# EAGLE design Charger Board_3 (EAGLE 6.5.0)
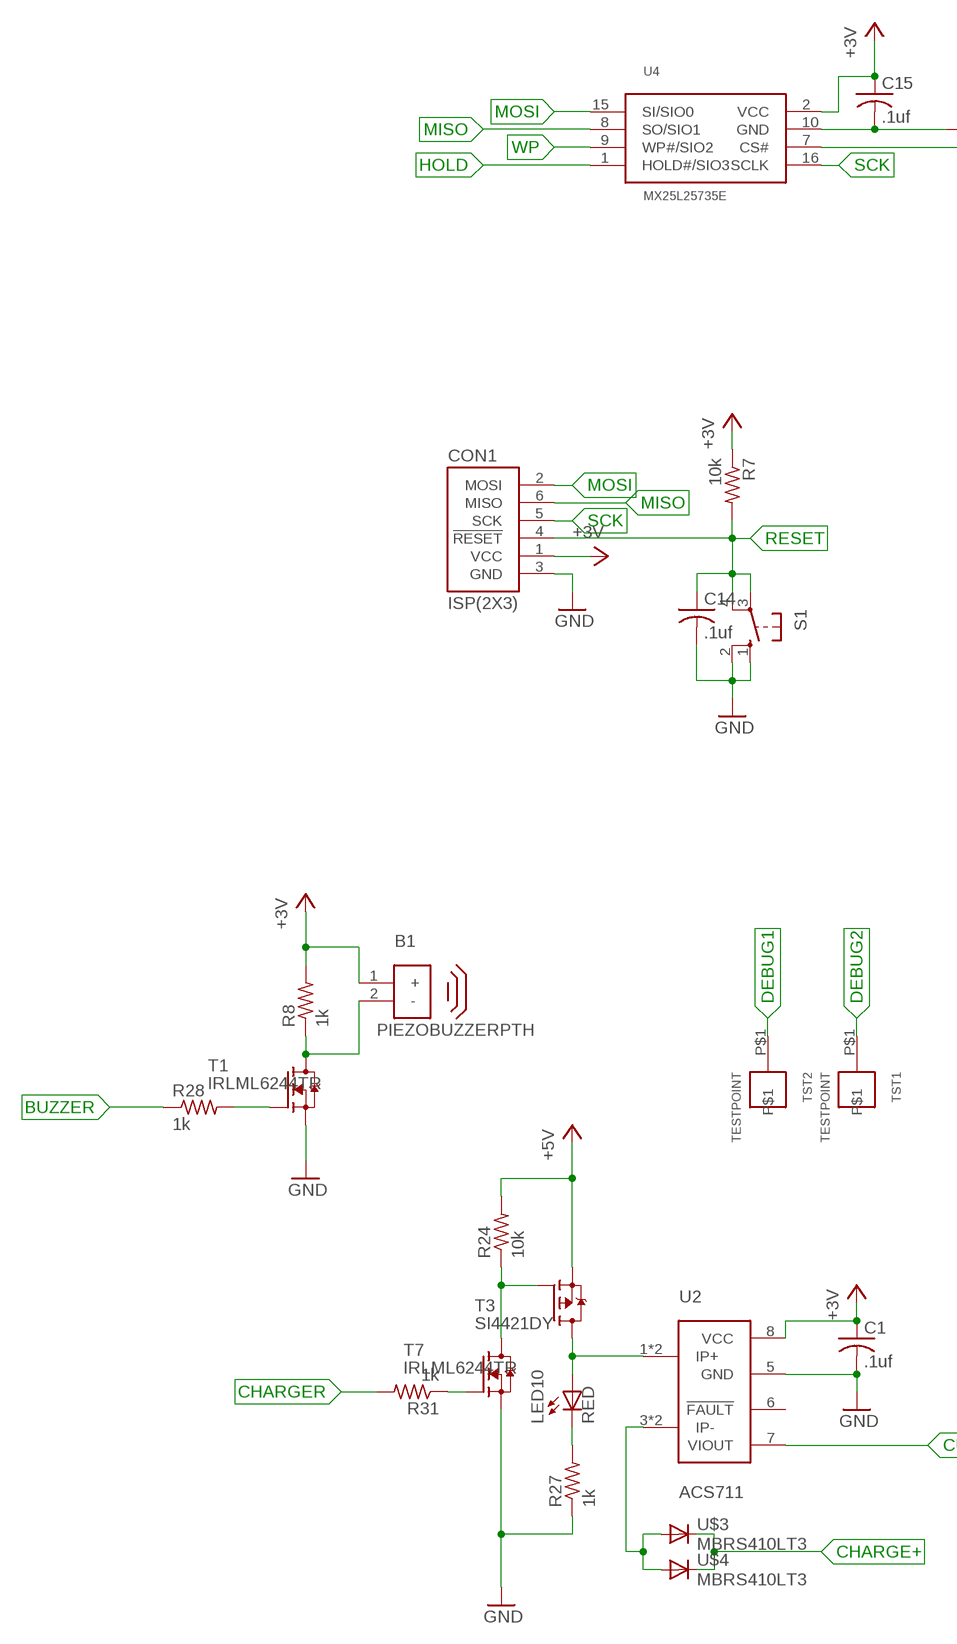
[diagram p0: schematic, sheet 1, part 1 of 2]
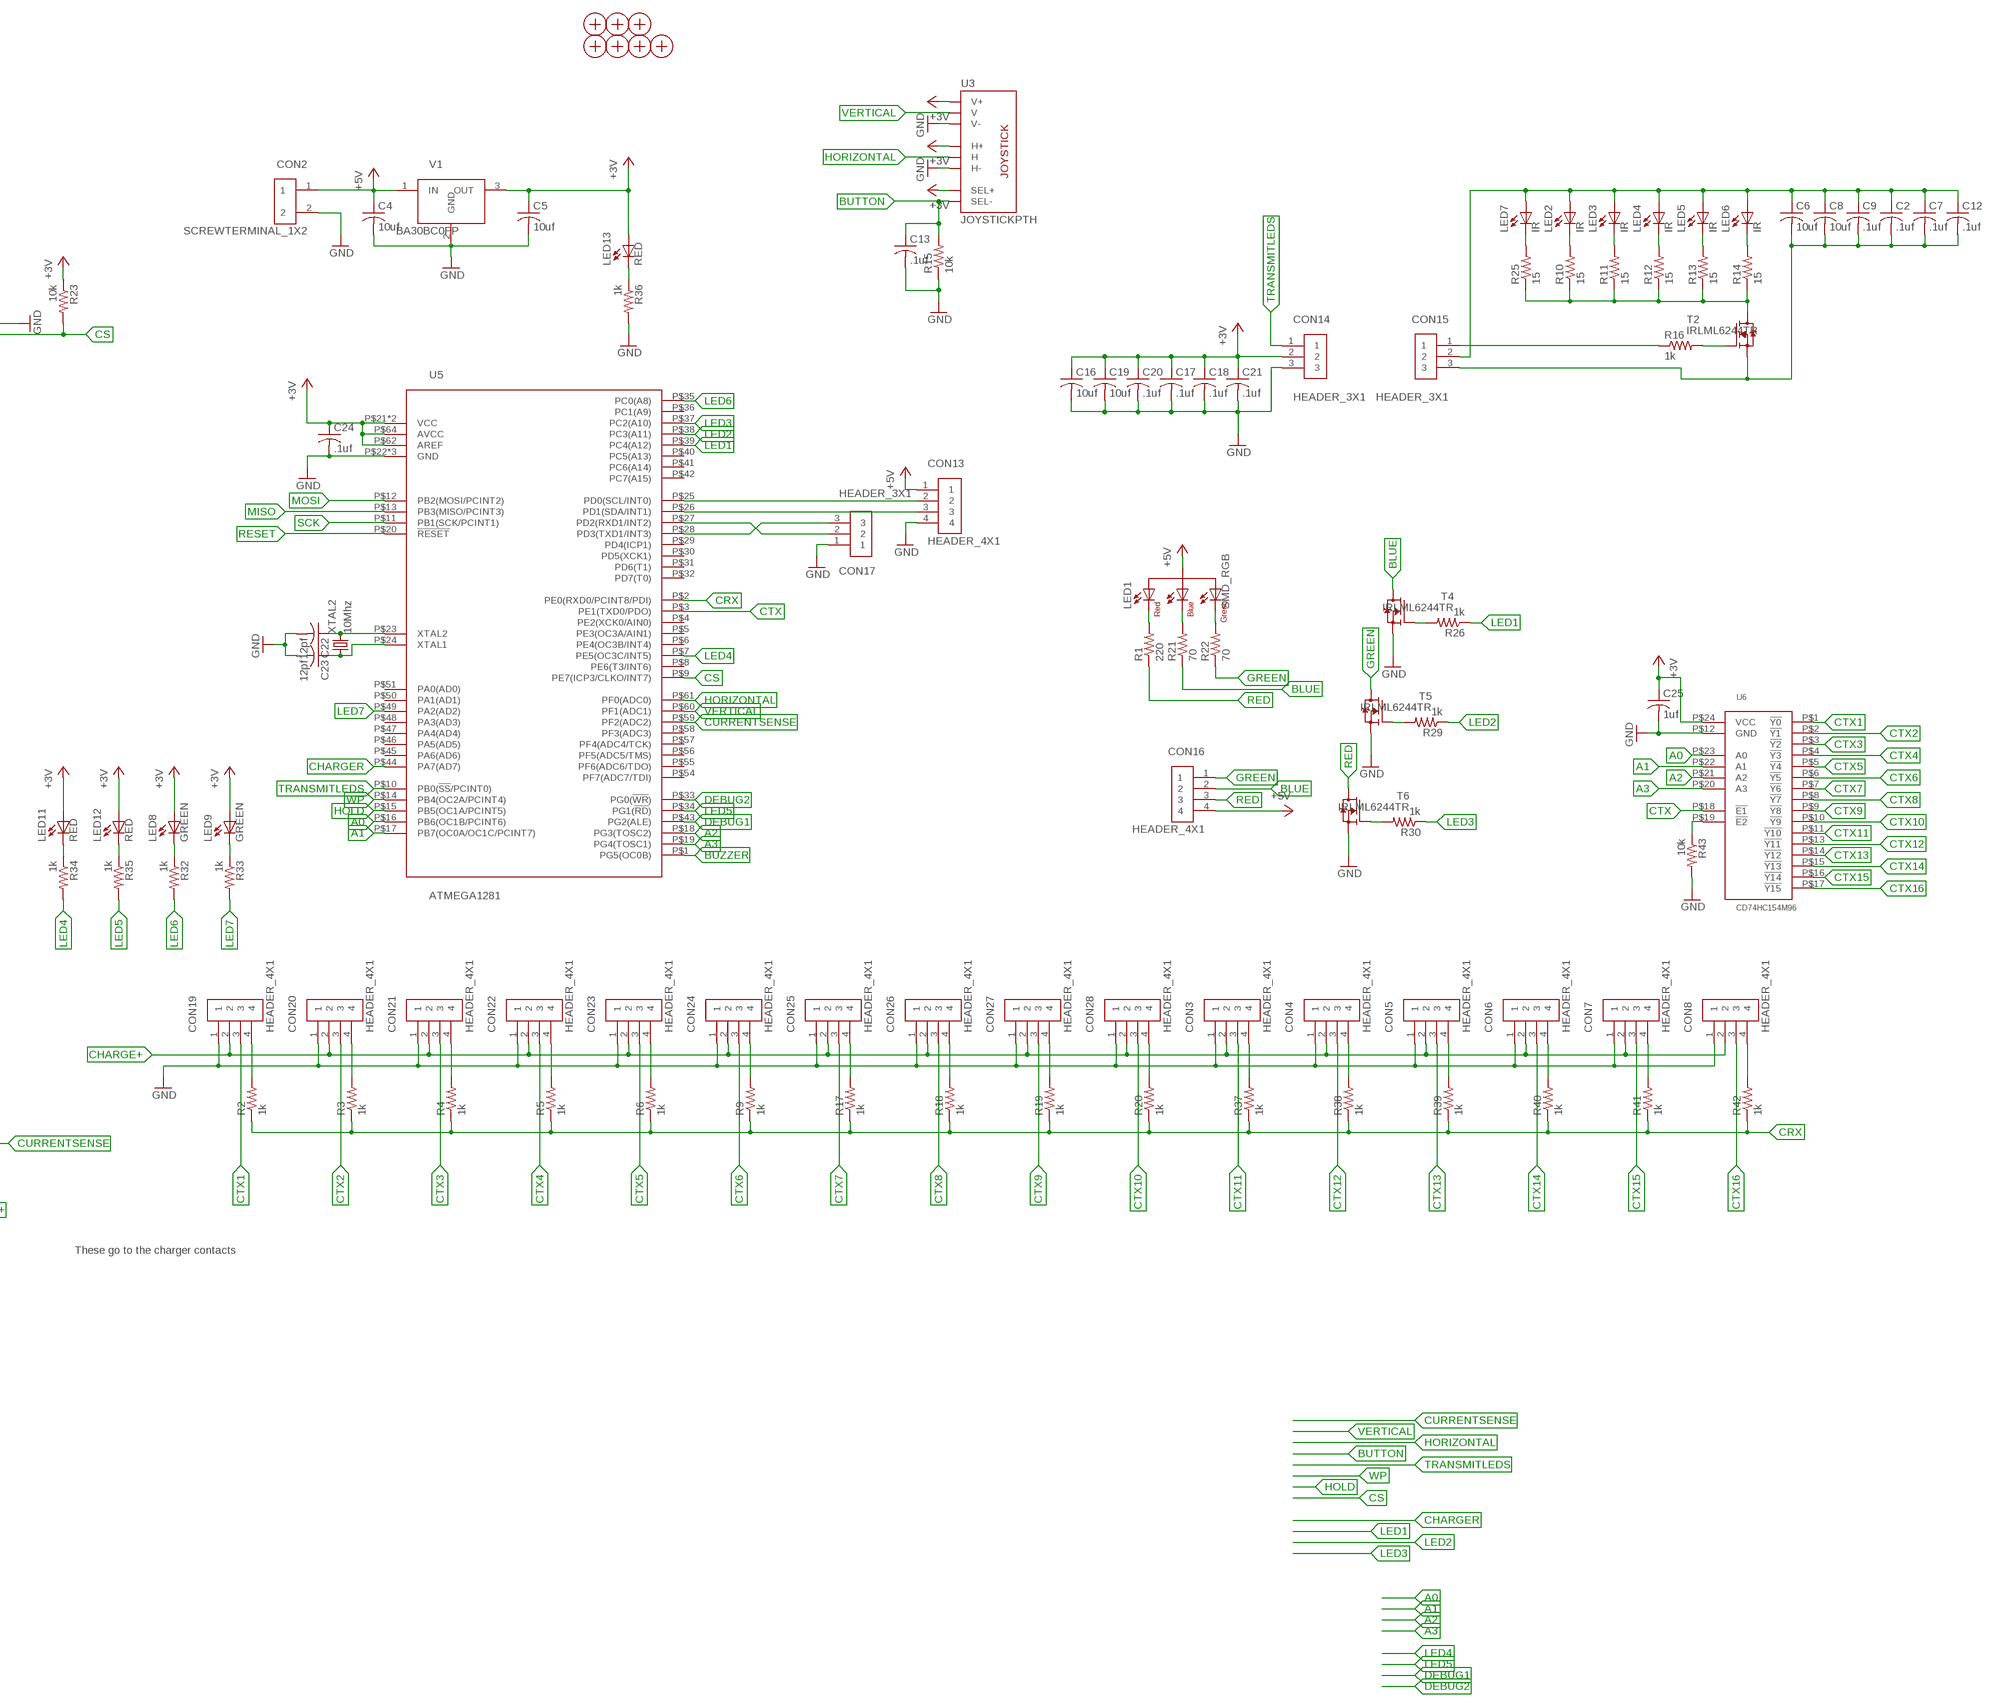
[diagram p1: schematic, sheet 1, part 2 of 2]

## Parts
B1  PIEZOBUZZERPTH  [PIEZOBUZZER]
C1  .1uf  CAP0603  [0603]
C2  .1uf  CAP0603  [0603]
C4  10uf  CAP0805  [0805]
C5  10uf  CAP0805  [0805]
C6  10uf  CAP0805  [0805]
C7  .1uf  CAP0603  [0603]
C8  10uf  CAP0805  [0805]
C9  .1uf  CAP0603  [0603]
C12  .1uf  CAP0603  [0603]
C13  .1uf  CAP0603  [0603]
C14  .1uf  CAP0603  [0603]
C15  .1uf  CAP0603  [0603]
C16  10uf  CAP0805  [0805]
C17  .1uf  CAP0603  [0603]
C18  .1uf  CAP0603  [0603]
C19  10uf  CAP0805  [0805]
C20  .1uf  CAP0603  [0603]
C21  .1uf  CAP0603  [0603]
C22  12pf  CAP0603  [0603]
C23  12pf  CAP0603  [0603]
C24  .1uf  CAP0603  [0603]
C25  1uf  CAP0603  [0603]
CON1  ISP(2X3)  [PINHEADER(2X3)]
CON2  SCREWTERMINAL_1X2  [SCREWTERMINAL_1X2]
CON3  HEADER_4X1  [4PINHEADER_.100"]
CON4  HEADER_4X1  [4PINHEADER_.100"]
CON5  HEADER_4X1  [4PINHEADER_.100"]
CON6  HEADER_4X1  [4PINHEADER_.100"]
CON7  HEADER_4X1  [4PINHEADER_.100"]
CON8  HEADER_4X1  [4PINHEADER_.100"]
CON13  HEADER_4X1  [4PINHEADER_.100"]
CON14  HEADER_3X1  [3PINHEADER_.100"]
CON15  HEADER_3X1  [3PINHEADER_.100"]
CON16  HEADER_4X1  [4PINHEADER_.100"]
CON17  HEADER_3X1  [3PINHEADER_.100"]
CON19  HEADER_4X1  [4PINHEADER_.100"]
CON20  HEADER_4X1  [4PINHEADER_.100"]
CON21  HEADER_4X1  [4PINHEADER_.100"]
CON22  HEADER_4X1  [4PINHEADER_.100"]
CON23  HEADER_4X1  [4PINHEADER_.100"]
CON24  HEADER_4X1  [4PINHEADER_.100"]
CON25  HEADER_4X1  [4PINHEADER_.100"]
CON26  HEADER_4X1  [4PINHEADER_.100"]
CON27  HEADER_4X1  [4PINHEADER_.100"]
CON28  HEADER_4X1  [4PINHEADER_.100"]
H1  MOUNTINGHOLE  [MOUNTINGHOLE]
H2  MOUNTINGHOLE  [MOUNTINGHOLE]
H3  MOUNTINGHOLE  [MOUNTINGHOLE]
H4  MOUNTINGHOLE  [MOUNTINGHOLE]
H5  MOUNTINGHOLE  [MOUNTINGHOLE]
H6  MOUNTINGHOLE  [MOUNTINGHOLE]
H7  MOUNTINGHOLE  [MOUNTINGHOLE]
LED1  SMD_RGB  [PLCC4]
LED2  IR  LED5MMRA  [5MM_LED_RA]
LED3  IR  LED5MMRA  [5MM_LED_RA]
LED4  IR  LED5MMRA  [5MM_LED_RA]
LED5  IR  LED5MMRA  [5MM_LED_RA]
LED6  IR  LED5MMRA  [5MM_LED_RA]
LED7  IR  LED5MMRA  [5MM_LED_RA]
LED8  GREEN  LED0603  [LED0603]
LED9  GREEN  LED0603  [LED0603]
LED10  RED  LED0603  [LED0603]
LED11  RED  LED0603  [LED0603]
LED12  RED  LED0603  [LED0603]
LED13  RED  LED0603  [LED0603]
R1  220  RES0603  [0603]
R2  1k  RES0603  [0603]
R3  1k  RES0603  [0603]
R4  1k  RES0603  [0603]
R5  1k  RES0603  [0603]
R6  1k  RES0603  [0603]
R7  10k  RES0603  [0603]
R8  1k  RES0603  [0603]
R9  1k  RES0603  [0603]
R10  15  RES0603  [0603]
R11  15  RES0603  [0603]
R12  15  RES0603  [0603]
R13  15  RES0603  [0603]
R14  15  RES0603  [0603]
R15  10k  RES0603  [0603]
R16  1k  RES0603  [0603]
R17  1k  RES0603  [0603]
R18  1k  RES0603  [0603]
R19  1k  RES0603  [0603]
R20  1k  RES0603  [0603]
R21  70  RES0603  [0603]
R22  70  RES0603  [0603]
R23  10k  RES0603  [0603]
R24  10k  RES0603  [0603]
R25  15  RES0603  [0603]
R26  1k  RES0603  [0603]
R27  1k  RES0603  [0603]
R28  1k  RES0603  [0603]
R29  1k  RES0603  [0603]
R30  1k  RES0603  [0603]
R31  1k  RES0603  [0603]
R32  1k  RES0603  [0603]
R33  1k  RES0603  [0603]
R34  1k  RES0603  [0603]
R35  1k  RES0603  [0603]
R36  1k  RES0603  [0603]
R37  1k  RES0603  [0603]
R38  1k  RES0603  [0603]
R39  1k  RES0603  [0603]
R40  1k  RES0603  [0603]
R41  1k  RES0603  [0603]
R42  1k  RES0603  [0603]
R43  10k  RES0603  [0603]
S1  10-XX  [B3F-10XX]
T1  IRLML6244TR  [SOT23]
T2  IRLML6244TR  [SOT23]
T3  SI4421DY  [S0-8]
T4  IRLML6244TR  [SOT23]
T5  IRLML6244TR  [SOT23]
T6  IRLML6244TR  [SOT23]
T7  IRLML6244TR  [SOT23]
TST1  TESTPOINT  [TESTPOINT]
TST2  TESTPOINT  [TESTPOINT]
U2  ACS711  [8SOIC]
U3  JOYSTICKPTH  [JOYSTICK]
U4  MX25L25735E  [SOIC16R]
U5  ATMEGA1281  [TQFP64]
U6  CD74HC154M96  [24SOIC]
U$3  MBRS410LT3  [SMD_DIODE]
U$4  MBRS410LT3  [SMD_DIODE]
V1  BA30BC0FP  [DPAK]
XTAL2  10Mhz  NX5032GA-10.000000MHZ  [SMDXTAL]

## Nets
+3V: B1.1(+) C1.1 C5.1 C15.1 C16.1 C17.1 C18.1 C19.1 C20.1 C21.1 C24.1 C25.1 CON1.1(VCC) CON14.2 LED8.2(A) LED9.2(A) LED11.2(A) LED12.2(A) LED13.2(A) R7.1 R8.2 R23.1 U2.8(VCC) U3.B1A(SEL+) U3.H1(H+) U3.V1(V+) U4.2(VCC) U5.P$21(VCC) U5.P$52(VCC) U5.P$62(AREF) U5.P$64(AVCC) U6.P$24(VCC) V1.3(OUT)
+5V: C4.1 CON2.1 CON13.1 CON16.4 LED1.2(COMMONANODE) R24.2 T3.1(S) T3.2(S) T3.3(S) V1.1(IN)
A0: U5.P$16(PB6(OC1B/PCINT6)) U6.P$23(A0)
A1: U5.P$17(PB7(OC0A/OC1C/PCINT7)) U6.P$22(A1)
A2: U5.P$18(PG3(TOSC2)) U6.P$21(A2)
A3: U5.P$19(PG4(TOSC1)) U6.P$20(A3)
BLUE: CON16.2 R21.1 T4.3(D)
BUTTON: C13.1 R15.2 U3.B2A(SEL-)
BUZZER: R28.1 U5.P$1(PG5(OC0B))
CHARGE+: CON3.2 CON4.2 CON5.2 CON6.2 CON7.2 CON8.2 CON19.2 CON20.2 CON21.2 CON22.2 CON23.2 CON24.2 CON25.2 CON26.2 CON27.2 CON28.2 U$3.2(C) U$4.2(C)
CHARGER: R31.2 U5.P$44(PA7(AD7))
CRX: R2.1 R3.1 R4.1 R5.1 R6.1 R9.1 R17.1 R18.1 R19.1 R20.1 R37.1 R38.1 R39.1 R40.1 R41.1 R42.1 U5.P$2(PE0(RXD0/PCINT8/PDI))
CS: R23.2 U4.7(CS#) U5.P$9(PE7(ICP3/CLKO/INT7))
CTX: U5.P$3(PE1(TXD0/PDO)) U6.P$18(!E1)
CTX1: CON19.3 U6.P$1(!Y0)
CTX2: CON20.3 U6.P$2(!Y1)
CTX3: CON21.3 U6.P$3(!Y2)
CTX4: CON22.3 U6.P$4(!Y3)
CTX5: CON23.3 U6.P$5(!Y4)
CTX6: CON24.3 U6.P$6(!Y5)
CTX7: CON25.3 U6.P$7(!Y6)
CTX8: CON26.3 U6.P$8(!Y7)
CTX9: CON27.3 U6.P$9(!Y8)
CTX10: CON28.3 U6.P$10(!Y9)
CTX11: CON3.3 U6.P$11(!Y10)
CTX12: CON4.3 U6.P$13(!Y11)
CTX13: CON5.3 U6.P$14(!Y12)
CTX14: CON6.3 U6.P$15(!Y13)
CTX15: CON7.3 U6.P$16(!Y14)
CTX16: CON8.3 U6.P$17(!Y15)
CURRENTSENSE: U2.7(VIOUT) U5.P$59(PF2(ADC2))
DEBUG1: TST2.P$1 U5.P$43(PG2(ALE))
DEBUG2: TST1.P$1 U5.P$33(PG0(!WR!))
GND: C1.2 C4.2 C5.2 C13.2 C14.2 C15.2 C16.2 C17.2 C18.2 C19.2 C20.2 C21.2 C22.2 C23.2 C24.2 C25.2 CON1.3(GND) CON2.2 CON3.1 CON4.1 CON5.1 CON6.1 CON7.1 CON8.1 CON13.4 CON14.3 CON17.1 CON19.1 CON20.1 CON21.1 CON22.1 CON23.1 CON24.1 CON25.1 CON26.1 CON27.1 CON28.1 R15.1 R27.1 R36.2 R43.2 S1.1(S) S1.2(S1) T1.2(S) T4.2(S) T5.2(S) T6.2(S) T7.2(S) U2.5(GND) U3.H3(H-) U3.V3(V-) U4.10(GND) U5.P$22(GND) U5.P$53(GND) U5.P$63(GND) U6.P$12(GND) V1.2(GND)
GREEN: CON16.1 R22.1 T5.3(D)
HOLD: U4.1(HOLD#/SIO3) U5.P$15(PB5(OC1A/PCINT5))
HORIZONTAL: U3.H2(H) U5.P$61(PF0(ADC0))
LED1: R26.1 U5.P$39(PC4(A12))
LED2: R29.1 U5.P$38(PC3(A11))
LED3: R30.1 U5.P$37(PC2(A10))
LED4: R34.2 U5.P$7(PE5(OC3C/INT5))
LED5: R35.2 U5.P$34(PG1(!RD!))
LED6: R32.2 U5.P$35(PC0(A8))
LED7: R33.2 U5.P$49(PA2(AD2))
MISO: CON1.6(MISO) U4.8(SO/SIO1) U5.P$13(PB3(MISO/PCINT3))
MOSI: CON1.2(MOSI) U4.15(SI/SIO0) U5.P$12(PB2(MOSI/PCINT2))
N$1: LED10.2(A) T3.5(D) T3.6(D) T3.7(D) T3.8(D) U2.1(IP+) U2.2(IP+)
N$2: CON15.1 R16.1
N$3: C2.1 C6.1 C7.1 C8.1 C9.1 C12.1 CON15.2 LED2.1(A) LED3.1(A) LED4.1(A) LED5.1(A) LED6.1(A) LED7.1(A)
N$5: C2.2 C6.2 C7.2 C8.2 C9.2 C12.2 CON15.3 T2.2(S)
N$6: LED7.2(C) R25.2
N$9: B1.2(-) R8.1 T1.3(D)
N$10: R10.1 R11.1 R12.1 R13.1 R14.1 R25.1 T2.3(D)
N$11: R16.2 T2.1(G)
N$13: LED2.2(C) R10.2
N$14: LED3.2(C) R11.2
N$15: LED4.2(C) R12.2
N$16: LED5.2(C) R13.2
N$17: LED6.2(C) R14.2
N$20: R24.1 T3.4(G) T7.3(D)
N$21: R31.1 T7.1(G)
N$22: LED10.1(C) R27.2
N$23: U2.3(IP-) U2.4(IP-) U$3.1(A) U$4.1(A)
N$24: CON20.4 R3.2
N$26: R28.2 T1.1(G)
N$27: CON19.4 R2.2
N$28: CON21.4 R4.2
N$29: CON22.4 R5.2
N$30: CON23.4 R6.2
N$31: CON24.4 R9.2
N$32: CON25.4 R17.2
N$33: CON26.4 R18.2
N$34: CON27.4 R19.2
N$35: CON28.4 R20.2
N$36: R26.2 T4.1(G)
N$37: LED1.1(REDCATHODE) R1.2
N$38: LED1.3(BLUECATHODE) R21.2
N$39: LED1.4(GREENCATHODE) R22.2
N$40: R29.2 T5.1(G)
N$41: R30.2 T6.1(G)
N$42: LED8.1(C) R32.1
N$43: LED9.1(C) R33.1
N$44: LED11.1(C) R34.1
N$45: LED12.1(C) R35.1
N$46: LED13.1(C) R36.1
N$47: C22.1 U5.P$23(XTAL2) XTAL2.2
N$48: C23.1 U5.P$24(XTAL1) XTAL2.1
N$49: CON3.4 R37.2
N$50: CON4.4 R38.2
N$51: CON5.4 R39.2
N$52: CON6.4 R40.2
N$53: CON7.4 R41.2
N$54: CON8.4 R42.2
N$55: CON13.2 U5.P$25(PD0(SCL/INT0))
N$56: CON13.3 U5.P$26(PD1(SDA/INT1))
N$57: R43.1 U6.P$19(!E2)
N$60: CON17.2 U5.P$27(PD2(RXD1/INT2))
N$61: CON17.3 U5.P$28(PD3(TXD1/INT3))
RED: CON16.3 R1.1 T6.3(D)
RESET: C14.1 CON1.4(!RESET) R7.2 S1.3(P) S1.4(P1) U5.P$20(!RESET!)
SCK: CON1.5(SCK) U4.16(SCLK) U5.P$11(PB1(SCK/PCINT1))
TRANSMITLEDS: CON14.1 U5.P$10(PB0(!SS!/PCINT0))
VERTICAL: U3.V2(V) U5.P$60(PF1(ADC1))
WP: U4.9(WP#/SIO2) U5.P$14(PB4(OC2A/PCINT4))
Unconnected: U2.6(!FAULT) U5.P$4(PE2(XCK0/AIN0)) U5.P$5(PE3(OC3A/AIN1)) U5.P$6(PE4(OC3B/INT4)) U5.P$8(PE6(T3/INT6)) U5.P$29(PD4(ICP1)) U5.P$30(PD5(XCK1)) U5.P$31(PD6(T1)) U5.P$32(PD7(T0)) U5.P$36(PC1(A9)) U5.P$40(PC5(A13)) U5.P$41(PC6(A14)) U5.P$42(PC7(A15)) U5.P$45(PA6(AD6)) U5.P$46(PA5(AD5)) U5.P$47(PA4(AD4)) U5.P$48(PA3(AD3)) U5.P$50(PA1(AD1)) U5.P$51(PA0(AD0)) U5.P$54(PF7(ADC7/TDI)) U5.P$55(PF6(ADC6/TDO)) U5.P$56(PF5(ADC5/TMS)) U5.P$57(PF4(ADC4/TCK)) U5.P$58(PF3(ADC3))

## Notes on the sheet
- These go to the charger contacts

## Library data of the parts
B1 = Passive:PIEZOBUZZER: Digikey Part Number: 445-2525-1-ND Manufacturer Part Number: PS1240P02BT
C1 C2 C4-C9 C12-C25 = Passive:CAP
CON1 = Mechanical:ISP
CON2 = Mechanical:SCREWTERMINAL_1X2: Digikey Part Number: ED1631-ND Manufacturer Part Number: ED700/2
CON3-CON8 CON13 CON16 CON19-CON28 = Mechanical:HEADER_4X1
CON14 CON15 CON17 = Mechanical:HEADER_3X1
H1-H7 = Mechanical:MOUNTINGHOLE
LED1 = Passive:SMD_RGB: Digikey Part Number: CLVBA-FKA-CAEDH8BBB7A363CT-ND Manufacturer Part Number: CLVBA-FKA-CAEDH8BBB7A363
LED2-LED13 = Passive:LED
R1-R43 = Passive:RES
S1 = switch-omron:10-XX: OMRON SWITCH; MPN: B3F-1000; OC_FARNELL: 176432; OC_NEWARK: 36M3542
T1 T2 T4-T7 = Passive:IRLML6244TR: Digikey Part Number: IRLML6244TRPBFCT-ND Manufacturer Part Number: IRLML6244TRPBF
T3 = Passive:SI4421DY: Digikey Part Number: SI4421DY-T1-E3CT-ND Manufacturer Part Number: SI4421DY-T1-E3
TST1 TST2 = Mechanical:TESTPOINT
U2 = PowerIC:ACS711
U3 = SparkFun:JOYSTICK: Thumb Joystick Joystick commonly found in PS2 controllers. Two pots and a select switch. Footprint proven. Spark Fun Electronics SKU : COM-09032
U4 = DigitalIC:MX25L25735E: Digikey Part Number: 1092-1000-ND Manufacturer Part Number: MX25L25735EMI-12G
U5 = DigitalIC:ATMEGA1281: Digikey Part Number: ATMEGA1281V-8AU-ND Manufacturer Part Number: ATMEGA1281V-8AU
U6 = DigitalIC:CD74HC154M96: Digikey Part Number: 296-24352-1-ND Manufacturer Part Number: CD74HC154M96
U$3 U$4 = Passive:MBRS410LT3: Digikey Part Number: MBRS410LT3GOSCT-ND Manufacturer Part Number: MBRS410LT3G
V1 = PowerIC:BA30BC0FP: Digikey Part Number: BA30BC0FP-E2CT-ND Manufacturer Cart Number: BA30BC0FP-E2
XTAL2 = Passive:NX5032GA-10.000000MHZ: Digikey Part Number: 644-1033-1-ND Manufacturer Part Number: NX5032GA-10.000000MHZ-LN-CD-1

## Board
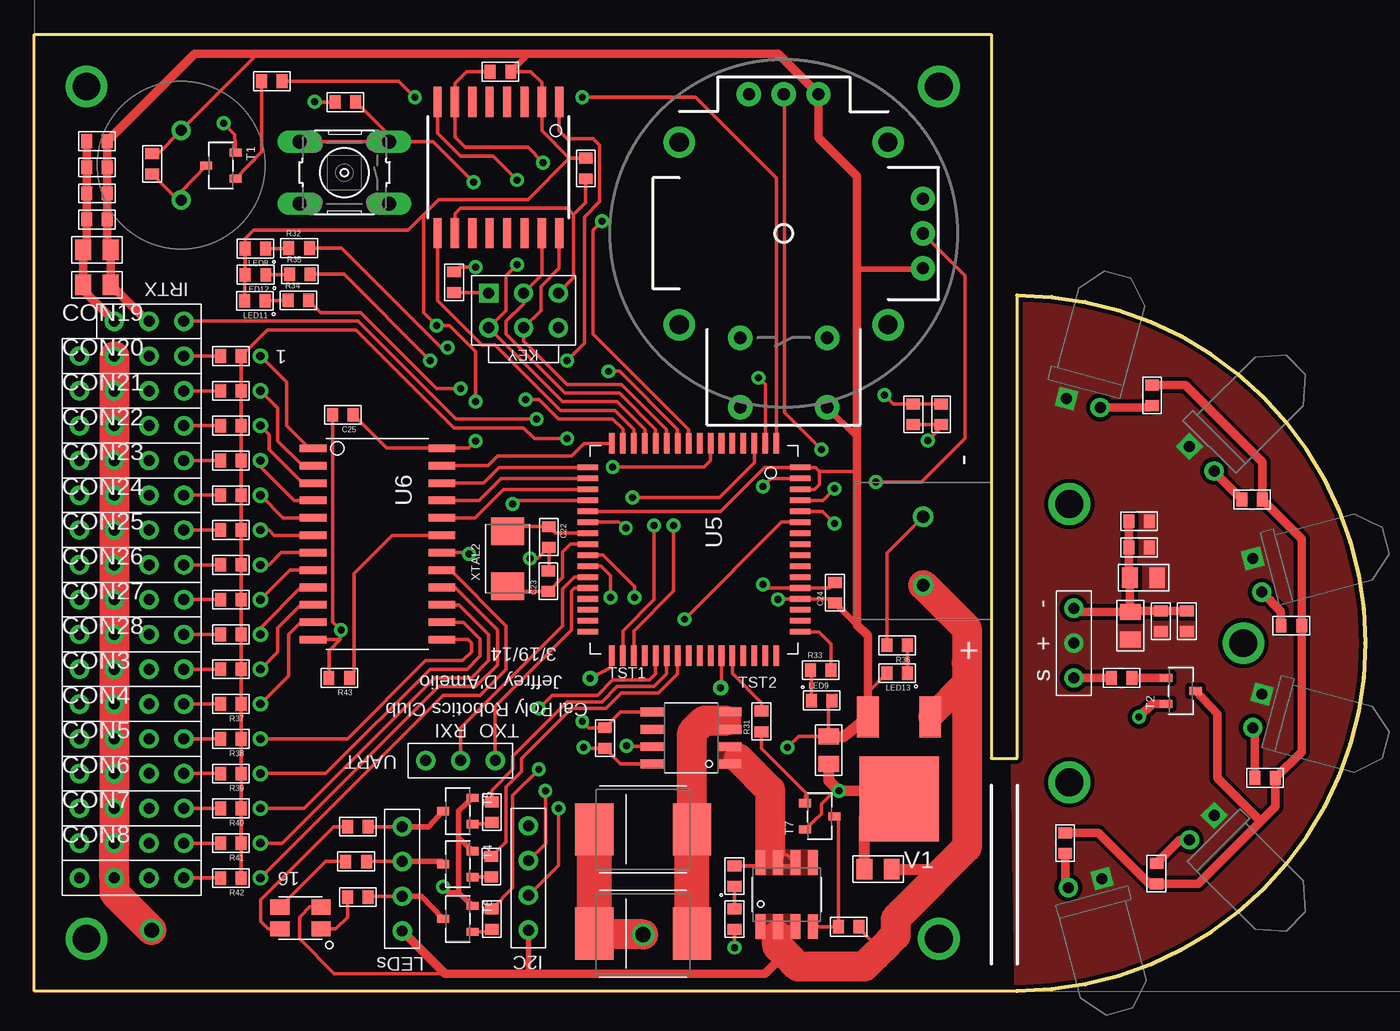
[diagram p2: board, top side]
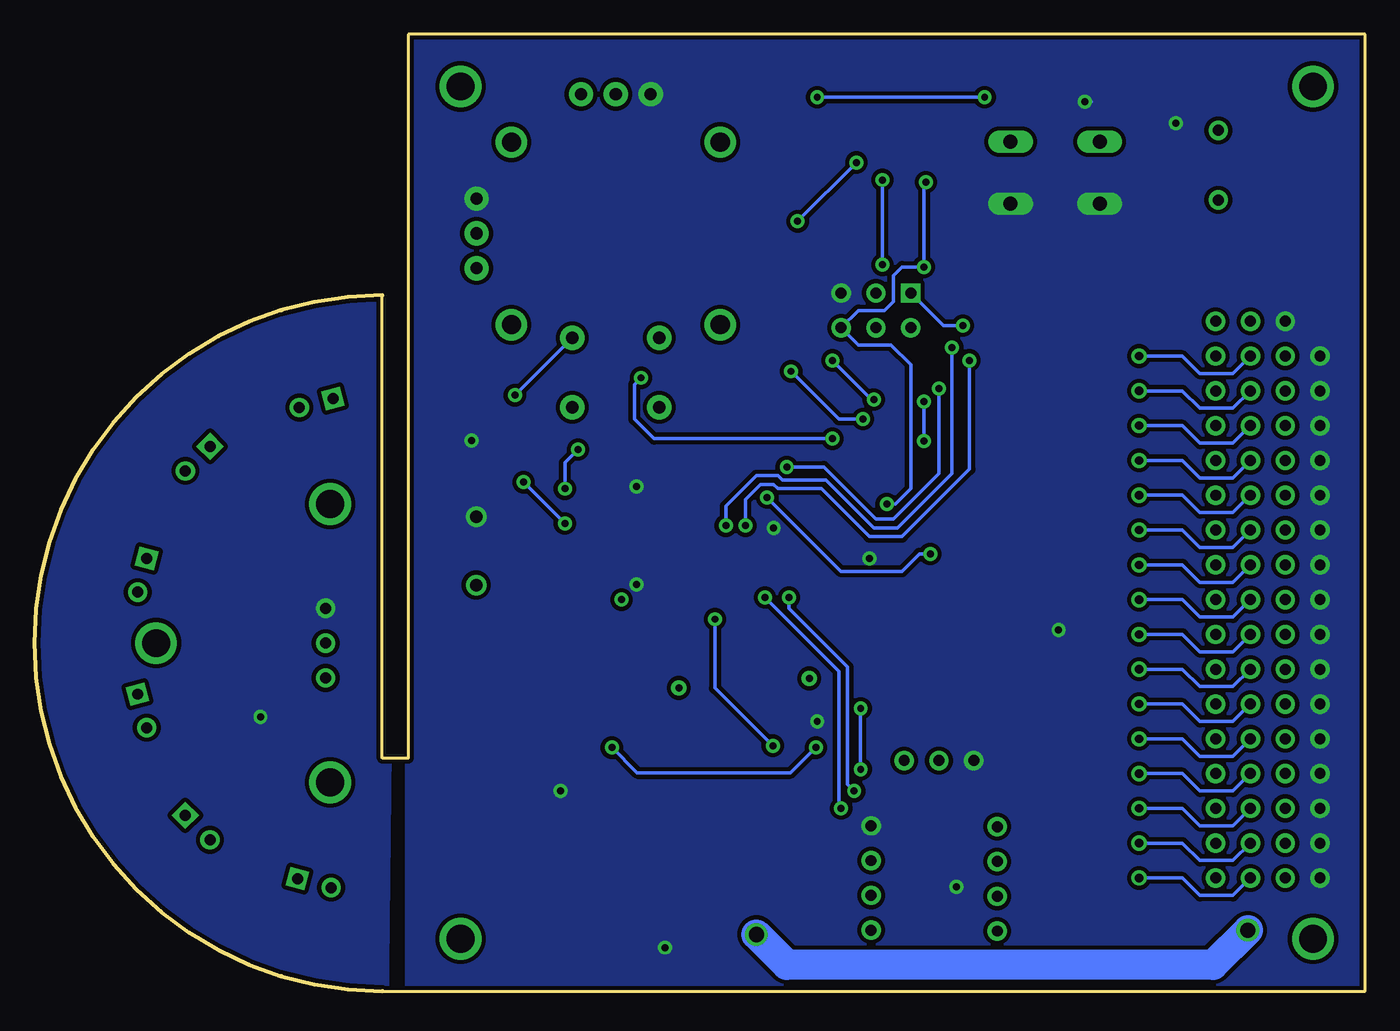
[diagram p3: board, bottom side, seen from below]

Size 97.16 x 69.85 mm. Coordinates in mm from the lower left corner, seen from the top.
Outline: 71.75,50.8 arc-180 71.75,0 0,0 0,69.85 69.85,69.85 69.85,17 71.75,17 71.75,50.8
Copper layers (1*16): Top 0.035mm / dielectric 1.5mm / Bottom 0.035mm
Design rules "SparkFunDRC": minimum track width 8mil, minimum drill 20mil, track to track 8mil, track to pad 8mil, pad to pad 8mil, via to via 8mil, smd to smd 8mil, copper to edge 10mil, drill to drill 8mil, minimum pad ring 12mil, minimum via ring 10mil, stop-mask expansion 4mil, vias tented up to drill 25mil, thermal gap 10mil

### Footprints (pad centres in the part's own frame; a part is rotated, then mirrored left to right if it is on the bottom)
PIEZOBUZZER = drill 0.8: 1 -2.54,0; 2 2.54,0
0603 = smd 0.8 x 1: 1 -0.75,0; 2 0.75,0
0805 = smd 1.15 x 1.5: 1 -1,0; 2 1,0
PINHEADER(2X3) = drill 0.8 square: 1 -2.54,1.27 | drill 0.8: 2 0,1.27; 3 2.54,1.27; 4 2.54,-1.27; 5 0,-1.27; 6 -2.54,-1.27
SCREWTERMINAL_1X2 = drill 0.9: 1 -2.5,0; 2 2.5,0
4PINHEADER_.100" = drill 0.8: 1 -2.54,0; 2 0,0; 3 2.54,0; 4 5.08,0
3PINHEADER_.100" = drill 0.8: 1 -2.54,0; 2 0,0; 3 2.54,0
MOUNTINGHOLE = drill 2.032 pad 2.286: P$2 0,0
PLCC4 = smd 1.4 x 1.1: 1 -1.5,0.8; 2 -1.5,-0.8; 3 1.5,-0.8; 4 1.5,0.8
5MM_LED_RA = drill 0.8 square: 1 -1.27,0 | drill 0.8: 2 1.27,0
LED0603 = smd 0.8 x 1: 1 -0.75,0; 2 0.75,0
B3F-10XX = drill 1.016 long: 1 -3.251,2.261; 2 3.251,2.261; 3 -3.251,-2.261; 4 3.251,-2.261
SOT23 = smd 0.6 x 0.889: 1 0.95,1.079; 2 -0.95,1.079; 3 0,-1.079
S0-8 = smd 0.72 x 1.78: 1 -1.905,-2.34; 2 -0.635,-2.34; 3 0.635,-2.34; 4 1.905,-2.34; 5 1.905,2.34; 6 0.635,2.34; 7 -0.635,2.34; 8 -1.905,2.34
TESTPOINT = drill 0.508: P$1 0,0
8SOIC = smd 0.65 x 1.75: 1 -1.905,-2.8; 2 -0.635,-2.8; 3 0.635,-2.8; 4 1.905,-2.8; 5 1.905,2.8; 6 0.635,2.8; 7 -0.635,2.8; 8 -1.905,2.8
JOYSTICK = drill 0.9 pad 1.778: B1A -3.175,12.7; B1B 3.175,12.7; B2A -3.175,7.62; B2B 3.175,7.62 | drill 0.889 pad 1.778: H1 -2.54,-10.16; H2 0,-10.16; H3 2.54,-10.16; V1 -10.16,2.54; V2 -10.16,0; V3 -10.16,-2.54 | drill 1.397 pad 2.286: MOUNT1 -7.62,6.668; MOUNT2 -7.62,-6.668; MOUNT3 7.62,-6.668; MOUNT4 7.62,6.668
SOIC16R = smd 0.6 x 2.2: 1 -4.445,-4.775; 2 -3.175,-4.775; 3 -1.905,-4.775; 4 -0.635,-4.775; 5 0.635,-4.775; 6 1.905,-4.775; 7 3.175,-4.775; 8 4.445,-4.775; 9 4.445,4.8; 10 3.175,4.8; 11 1.905,4.8; 12 0.635,4.8; 13 -0.635,4.8; 14 -1.905,4.8; 15 -3.175,4.8; 16 -4.445,4.8
TQFP64 = smd 1.5 x 0.406: P$1 -7.75,6; P$2 -7.75,5.2; P$3 -7.75,4.4; P$4 -7.75,3.6; P$5 -7.75,2.8; P$6 -7.75,2; P$7 -7.75,1.2; P$8 -7.75,0.4; P$9 -7.75,-0.4; P$10 -7.75,-1.2; P$11 -7.75,-2; P$12 -7.75,-2.8; P$13 -7.75,-3.6; P$14 -7.75,-4.4; P$15 -7.75,-5.2; P$16 -7.75,-6; P$33 7.75,-6; P$34 7.75,-5.2; P$35 7.75,-4.4; P$36 7.75,-3.6; P$37 7.75,-2.8; P$38 7.75,-2; P$39 7.75,-1.2; P$40 7.75,-0.4; P$41 7.75,0.4; P$42 7.75,1.2; P$43 7.75,2; P$44 7.75,2.8; P$45 7.75,3.6; P$46 7.75,4.4; P$47 7.75,5.2; P$48 7.75,6 | smd 0.406 x 1.5: P$17 -6,-7.75; P$18 -5.2,-7.75; P$19 -4.4,-7.75; P$20 -3.6,-7.75; P$21 -2.8,-7.75; P$22 -2,-7.75; P$23 -1.2,-7.75; P$24 -0.4,-7.75; P$25 0.4,-7.75; P$26 1.2,-7.75; P$27 2,-7.75; P$28 2.8,-7.75; P$29 3.6,-7.75; P$30 4.4,-7.75; P$31 5.2,-7.75; P$32 6,-7.75; P$49 6,7.75; P$50 5.2,7.75; P$51 4.4,7.75; P$52 3.6,7.75; P$53 2.8,7.75; P$54 2,7.75; P$55 1.2,7.75; P$56 0.4,7.75; P$57 -0.4,7.75; P$58 -1.2,7.75; P$59 -2,7.75; P$60 -2.8,7.75; P$61 -3.6,7.75; P$62 -4.4,7.75; P$63 -5.2,7.75; P$64 -6,7.75
24SOIC = smd 0.55 x 1.95: P$1 -6.985,-4.7; P$2 -5.715,-4.7; P$3 -4.445,-4.7; P$4 -3.175,-4.7; P$5 -1.905,-4.7; P$6 -0.635,-4.7; P$7 0.635,-4.7; P$8 1.905,-4.7; P$9 3.175,-4.7; P$10 4.445,-4.7; P$11 5.715,-4.7; P$12 6.985,-4.7; P$13 6.985,4.7; P$14 5.715,4.7; P$15 4.445,4.7; P$16 3.175,4.7; P$17 1.905,4.7; P$18 0.635,4.7; P$19 -0.635,4.7; P$20 -1.905,4.7; P$21 -3.175,4.7; P$22 -4.445,4.7; P$23 -5.715,4.7; P$24 -6.985,4.7
SMD_DIODE = smd 2.794 x 3.81: 1 -3.568,0; 2 3.568,0
DPAK = smd 1.6 x 3: 1 -2.28,-5.99; 3 2.28,-5.99 | smd 5.8 x 6.2: 2 0,0
SMDXTAL = smd 2 x 2.4: 1 -2,0; 2 2,0

### Placement (x,y rotation side)
B1  10.73,60.29 270 top
C1  41.66,18.48 90 top
C2  84.14,26.99 90 top
C4  61.59,8.89 180 top
C5  57.98,17.59 270 top
C6  80.01,26.67 90 top
C7  80.64,34.29 180 top
C8  80.96,30.16 180 top
C9  80.64,32.38 180 top
C12  82.23,26.99 90 top
C13  64.17,42.1 270 top
C14  22.7,64.9 180 top
C15  40.26,60.04 270 top
C16  4.57,51.56 180 top
C17  4.57,58.23 180 top
C18  4.57,56.32 180 top
C19  4.57,54.1 180 top
C20  4.57,62.04 180 top
C21  4.57,60.13 180 top
C22  37.56,33.15 270 top
C23  37.53,29.91 90 top
C24  58.45,29.08 90 top
C25  22.54,42.07 180 top
CON1  35.72,49.69 0 top
CON2  64.9,32.13 90 top
CON3  5.84,20.95 0 top
CON4  5.84,18.41 0 top
CON5  5.84,15.88 0 top
CON6  5.84,13.34 0 top
CON7  5.84,10.79 0 top
CON8  5.84,8.26 0 top
CON13  36.07,6.99 90 top
CON14  8.38,48.9 180 top
CON15  75.88,25.4 90 top
CON16  26.86,9.46 270 top
CON17  31.11,16.83 0 top
CON19  5.84,46.35 0 top
CON20  5.84,43.81 0 top
CON21  5.84,41.27 0 top
CON22  5.84,38.73 0 top
CON23  5.84,36.2 0 top
CON24  5.84,33.66 0 top
CON25  5.84,31.11 0 top
CON26  5.84,28.57 0 top
CON27  5.84,26.04 0 top
CON28  5.84,23.5 0 top
H1  3.81,3.81 0 top
H2  3.81,66.04 0 top
H3  66.04,66.04 0 top
H4  66.04,3.81 0 top
H5  75.56,35.56 0 top
H6  75.56,15.24 0 top
H7  88.27,25.4 0 top
LED1  19.43,5.33 180 top
LED2  89.28,20.45 255 top
LED3  76.71,7.87 195 top
LED4  85.22,38.87 315 top
LED5  76.58,42.93 345 top
LED6  89.28,30.35 285 top
LED7  85.22,11.93 225 top
LED8  16.13,54.2 180 top
LED9  57.47,21.21 0 top
LED10  51.12,8.38 90 top
LED11  16.1,50.39 180 top
LED12  16.16,52.29 180 top
LED13  62.99,23.21 180 top
R1  23.62,6.86 180 top
R2  14.35,46.35 180 top
R3  14.35,43.81 180 top
R4  14.35,41.27 180 top
R5  14.35,38.73 180 top
R6  14.35,36.2 180 top
R7  30.64,51.75 90 top
R8  8.6,60.39 90 top
R9  14.35,33.66 180 top
R10  89.85,15.56 180 top
R11  75.25,10.79 270 top
R12  88.9,35.88 180 top
R13  81.6,43.5 270 top
R14  91.76,26.67 180 top
R15  66.2,42.1 90 top
R16  79.38,22.86 0 top
R17  14.35,31.11 180 top
R18  14.35,28.57 180 top
R19  14.35,26.04 180 top
R20  14.35,23.5 180 top
R21  23.5,9.46 180 top
R22  23.62,12 180 top
R23  34.04,67.12 180 top
R24  59.44,4.7 0 top
R25  81.92,8.57 90 top
R26  33.37,9.08 270 top
R27  51.12,5.27 90 top
R28  17.34,66.42 180 top
R29  33.4,13.05 270 top
R30  33.4,5.27 270 top
R31  53.09,19.68 90 top
R32  19.34,54.23 0 top
R33  57.4,23.43 0 top
R34  19.27,50.42 0 top
R35  19.4,52.32 0 top
R36  62.99,25.24 180 top
R37  14.35,20.95 180 top
R38  14.35,18.41 180 top
R39  14.35,15.88 180 top
R40  14.35,13.34 180 top
R41  14.35,10.79 180 top
R42  14.35,8.26 180 top
R43  22.26,22.86 180 top
S1  22.64,59.75 180 top
T1  13.62,60.26 270 top
T2  83.69,21.91 90 top
T3  54.93,7.05 0 top
T4  30.92,9.27 270 top
T5  30.92,13.14 270 top
T6  30.92,5.27 270 top
T7  57.34,12.76 90 top
TST1  40.58,22.83 0 top
TST2  50.1,22.13 0 top
U2  47.94,18.48 90 top
U3  54.71,55.31 180 top
U4  33.88,60.13 180 top
U5  48.16,32.23 270 top
U6  25.05,32.64 270 top
U$3  44.45,4.19 180 top
U$4  44.45,11.81 180 top
V1  63.12,14.03 180 top
XTAL2  34.54,31.56 90 top

### Tracks (layer width: path | path; a pad name or v marks a point on that pad's centre or on a via)
+3V  (via drill 0.51)
  Top 0.254: U2.8 42.81,16.57 C1.1 40.31,17.73 v40.1,17.78 | v54.99,17.78 55.77,18.59 C5.1 57.98,20.97 LED9.2 | V1.3 60.84,21.11 60.84,21.81 LED13.2 | C24.1 58.16,28.63 U5.P$52 54.34,28.63 v54.29,28.57 | U5.P$21 50.11,35.03 53.31,38.23 U5.P$64 57.02,38.23 57.31,37.94 | U5.P$62 56.95,36.63 57.31,36.99 57.31,37.94 | C25.1 25.74,39.62 U6.P$24 31.69,39.62 v32.23,40.16 | 57.31,37.94 60.05,37.94 | CON1.1 33.13,51 R7.1 | 39.05,60.8 37.05,62.8 U4.2 37.05,66.29 36.23,67.12 R23.1 | 39.05,60.8 40.25,60.8 C15.1 | 39.05,60.8 36.04,57.78 29.53,57.78 28.42,56.67 | 28.42,56.67 28.42,49.53 v29.37,48.58 30.32,48.58 32.23,46.67 v32.23,43.02 | 16.51,68.42 16.32,68.42 B1.1 9.04,61.14 R8.2 | LED8.2 15.41,54.17 | LED11.2 15.35,52.23 LED12.2 15.41,54.17 | 15.41,54.17 15.41,54.94 16.03,55.56 27.3,55.56 28.42,56.67 | 64.8,52.7 U3.V1
  Top 0.305: C19.1 5.32,54.35
  Top 0.406: C24.1 60.05,26.74 | 60.05,40.44 U3.B1A | 64.8,52.7 60.05,52.7 | R23.1 36.09,68.42
  Top 0.61: C19.1 C16.1 8.24,48.9 CON14.2 | 5.32,54.35 C18.1 C17.1 C21.1 C20.1 11.7,68.42 16.51,68.42 36.09,68.42 54.29,68.42 U3.H1 57.24,62.29 60.05,59.49 60.05,52.7 60.05,40.44 60.05,37.94 60.05,26.74 60.84,25.95 60.84,21.11
  Top 0.813: C5.1 59.09,18.59 V1.3
  Bottom 0.254: v54.99,17.78 53.15,15.94 41.94,15.94 v40.1,17.78 | v29.37,48.58 30.8,48.58 CON1.1 | v32.23,40.16 v32.23,43.02
+5V
  Top 0.254: T3.3 54.35,4.71 54.29,4.76 | T3.2 53.98,4.39 53.98,4.19 | 61.4,3.48 61.4,2.6 | 54.74,2.67 54.86,2.67 | R24.2 60.19,4.58 61.78,2.98 | LED1.2 20.1,6.13 19.37,5.4 19.37,3.81 21.91,1.27 29.97,1.27
  Top 0.406: 36.07,1.27 CON13.1
  Top 0.61: 54.74,2.67 53.34,1.27 36.07,1.27 29.97,1.27 CON16.4
  Top 0.813: C4.1 66.36,8.89 63.25,5.65
  Top 1.778: V1.1 68.07,22.7 68.07,23.97
  Top 2.184: 54.23,4.06 54.23,3.3 54.86,2.67 55.75,1.78 60.58,1.78 61.4,2.6 61.78,2.98 62.87,4.06 62.87,5.27 63.25,5.65 68.07,10.48 68.07,23.97 68.07,26.46 CON2.1
  pour Top (no thermals): 55.82,3.87 55.82,5.52 52.77,5.52 52.77,3.87
A0
  Top 0.254: U6.P$23 33.12,38.35 33.81,39.05 39.21,39.05 40.13,39.98 U5.P$16
A1
  Top 0.254: U5.P$17 33.94,38.23 32.8,37.08 U6.P$22
A2
  Top 0.254: U6.P$21 32.48,35.81 34.09,37.43 U5.P$18
A3
  Top 0.254: U6.P$20 32.16,34.54 34.24,36.63 U5.P$19
BLUE
  Top 0.254: R21.1 CON16.2
  Top 0.406: CON16.2 29.73,9.46 T4.3
BUTTON  (via drill 0.51)
  Top 0.254: R15.2 C13.1 62.72,42.85 v62.07,43.5
  Bottom 0.254: U3.B2A v62.07,43.5
BUZZER  (via drill 0.51)
  Top 0.254: U5.P$1 54.16,59.34 48.26,65.25 v40.01,65.25 | v27.78,65.25 26.61,66.42 R28.1
  Bottom 0.254: v40.01,65.25 v27.78,65.25
CHARGE+  (via drill 1.1)
  Top 2.184: CON19.2 CON20.2 CON21.2 CON22.2 CON23.2 CON24.2 CON25.2 CON26.2 CON27.2 CON28.2 CON3.2 CON4.2 CON5.2 CON6.2 CON7.2 CON8.2 5.84,7.18 v8.57,4.45 | v44.45,4.13 40.95,4.13 U$3.2
  Top 2.54: U$3.2 U$4.2
  Bottom 2.184: v8.57,4.45 11.11,1.91 42.23,1.91 v44.45,4.13
CHARGER
  Top 0.254: U5.P$44 50.97,23.17 53.09,21.05 R31.2
CRX  (via drill 0.51)
  Top 0.254: R42.1 R41.1 R40.1 R39.1 R38.1 R37.1 R20.1 R19.1 R18.1 R17.1 R9.1 R6.1 R5.1 R4.1 R3.1 R2.1 17.01,48.26 23.5,48.26 30.64,41.12 35.72,41.12 36.51,40.32 v38.89,40.32 | v52.86,44.77 53.37,44.27 U5.P$2
  Bottom 0.254: v38.89,40.32 51.91,40.32 53.34,41.75 53.34,44.29 v52.86,44.77
CS  (via drill 0.51)
  Top 0.254: R23.2 31.56,67.12 30.7,66.26 U4.7 30.7,62.33 31.43,61.59 36.04,61.59 v37.15,60.48 | U5.P$9 47.77,40.98 40.8,47.94 40.8,55.56 v41.43,56.2
  Bottom 0.254: v41.43,56.2 v37.15,60.48
CTX  (via drill 0.51)
  Top 0.254: U6.P$18 31.66,32 v31.75,31.91 | v43.66,36.04 50.01,36.04 52.56,38.59 U5.P$3
  Bottom 0.254: v31.75,31.91 32.54,31.91 33.81,30.64 38.26,30.64 v43.66,36.04
CTX1  (via drill 0.6)
  Top 0.254: 19.59,39.62 U6.P$1 20.07,39.62 18.41,41.27 18.41,44.45 v16.51,46.35
  Bottom 0.254: CON19.3 9.65,45.09 12.06,45.09 13.34,46.35 v16.51,46.35
CTX2  (via drill 0.6)
  Top 0.254: v16.51,43.81 17.78,42.55 17.78,40.16 19.59,38.35 U6.P$2
  Bottom 0.254: CON20.3 9.65,42.55 12.06,42.55 13.34,43.81 v16.51,43.81
CTX3  (via drill 0.6)
  Top 0.254: v16.51,41.27 17.14,40.64 17.14,39.53 19.59,37.08 U6.P$3
  Bottom 0.254: CON21.3 9.65,40.01 12.06,40.01 13.34,41.27 v16.51,41.27
CTX4  (via drill 0.6)
  Top 0.254: U6.P$4 18.95,35.81 16.51,38.26 v16.51,38.73
  Bottom 0.254: CON22.3 9.65,37.47 12.06,37.47 13.34,38.73 v16.51,38.73
CTX5  (via drill 0.6)
  Top 0.254: v16.51,36.2 18.16,34.54 U6.P$5
  Bottom 0.254: CON23.3 9.65,34.92 12.06,34.92 13.34,36.2 v16.51,36.2
CTX6  (via drill 0.6)
  Top 0.254: v16.51,33.66 17.14,33.66 17.53,33.27 U6.P$6
  Bottom 0.254: CON24.3 9.65,32.38 12.06,32.38 13.34,33.66 v16.51,33.66
CTX7  (via drill 0.6)
  Top 0.254: v16.51,31.11 17.14,31.11 18.03,32 U6.P$7
  Bottom 0.254: CON25.3 9.65,29.84 12.06,29.84 13.34,31.11 v16.51,31.11
CTX8  (via drill 0.6)
  Top 0.254: v16.51,28.57 18.67,30.73 U6.P$8
  Bottom 0.254: CON26.3 9.65,27.3 12.06,27.3 13.34,28.57 v16.51,28.57
CTX9  (via drill 0.6)
  Top 0.254: U6.P$9 19.46,29.46 16.51,26.51 v16.51,26.04
  Bottom 0.254: CON27.3 9.65,24.77 12.06,24.77 13.34,26.04 v16.51,26.04
CTX10  (via drill 0.6)
  Top 0.254: v16.51,23.5 17.78,24.77 17.78,26.51 19.46,28.19 U6.P$10
  Bottom 0.254: CON28.3 9.65,22.23 12.06,22.23 13.34,23.5 v16.51,23.5
CTX11  (via drill 0.6)
  Top 0.254: U6.P$11 19.46,26.92 18.57,26.04 18.57,23.02 v16.51,20.95
  Bottom 0.254: CON3.3 9.65,19.68 12.06,19.68 13.34,20.95 v16.51,20.95
CTX12  (via drill 0.6)
  Top 0.254: U6.P$13 31.66,25.65 31.91,25.4 31.91,24.77 31.27,24.13 28.57,24.13 22.86,18.41 v16.51,18.41
  Bottom 0.254: CON4.3 9.65,17.14 12.06,17.14 13.34,18.41 v16.51,18.41
CTX13  (via drill 0.6)
  Top 0.254: U6.P$14 31.34,26.92 32.54,25.72 32.54,24.45 31.59,23.5 28.89,23.5 21.27,15.88 v16.51,15.88
  Bottom 0.254: CON5.3 9.65,14.61 12.06,14.61 13.34,15.88 v16.51,15.88
CTX14  (via drill 0.6)
  Top 0.254: U6.P$15 31.02,28.19 33.18,26.04 33.18,24.13 31.91,22.86 29.21,22.86 19.68,13.34 v16.51,13.34
  Bottom 0.254: CON6.3 9.65,12.06 12.06,12.06 13.34,13.34 v16.51,13.34
CTX15  (via drill 0.6)
  Top 0.254: U6.P$16 30.7,29.46 33.81,26.35 33.81,23.81 32.23,22.23 29.53,22.23 18.1,10.79 v16.51,10.79
  Bottom 0.254: CON7.3 9.65,9.53 12.06,9.53 13.34,10.79 v16.51,10.79
CTX16  (via drill 0.6)
  Top 0.254: v16.51,8.26 29.84,21.59 32.54,21.59 34.45,23.5 34.45,26.67 30.39,30.73 U6.P$17
  Bottom 0.254: CON8.3 9.65,6.99 12.06,6.99 13.34,8.26 v16.51,8.26
CURRENTSENSE  (via drill 0.51)
  Top 0.254: v43.24,17.91 43.31,17.84 U2.7 | U5.P$59 54.55,34.23 v47.47,27.15
  Bottom 0.254: v47.47,27.15 47.47,22.13 v43.24,17.91
DEBUG1
  Top 0.254: U5.P$43 50.16,22.19 TST2.P$1
DEBUG2
  Top 0.254: U5.P$33 42.1,23.62 TST1.P$1
GND  (via drill 0.51)
  Top 0.254: C13.2 R15.1 66.2,41.15 v65.25,40.2 | R27.1 v51.12,3.17 | T7.2 57.47,12.94 57.47,13.65 58.42,14.61 v58.74,14.61 | U2.5 42.81,20.38 C1.2 40.46,19.23 v40.01,19.68 | R36.2 62.24,31.98 CON2.2 | U6.P$12 22.32,25.65 | 22.32,25.65 v22.38,26.35 21.79,26.94 C25.2 | C24.2 58.05,29.43 U5.P$53 53.56,29.43 v53.18,29.69 | U5.P$22 42.64,34.23 v43.18,33.81 | U5.P$63 53.78,37.43 v53.18,36.83 | R43.2 21.51,24.84 22.32,25.65 | C23.2 37.56,30.69 C22.2 36.76,31.59 v36.2,31.59 | U4.10 30.7,56.74 31.11,57.15 38.89,57.15 39.37,56.67 | 39.37,56.67 39.37,52.07 CON1.3 | C15.2 40.26,57.56 39.37,56.67 | T1.2 14.62,62.53 v13.81,63.34 | C14.2 20.51,64.9 v20.48,64.93
  Top 0.305: C19.2 3.82,54.35
  Top 0.406: 30.96,7.19 30.96,11.19 | 30.96,11.19 30.96,13.16 T5.2 | T4.2 30.96,11.19 | 30.96,7.19 30.28,7.19 v29.84,7.62 | T6.2 30.96,7.19
  Top 0.61: C19.2 C16.2 3.57,51.16 CON14.3 | 3.82,54.35 C18.2 C17.2 C21.2 C20.2
  Top 0.813: C5.2 57.98,15.37 v58.74,14.61 61.85,14.67 61.59,12.76 | 61.59,12.76 V1.2 | C4.2 60.59,12.72 61.59,12.76
  Bottom 0.254: v20.48,64.93 20,64.93
  pour Bottom (isolate 0.305, no thermals): 0,81.28 69.98,81.28 69.98,0 0,0
GREEN
  Top 0.254: R22.1 CON16.1
  Top 0.406: CON16.1 28.78,12 T5.3
HOLD  (via drill 0.51)
  Top 0.254: U5.P$15 42.97,41.01 42.23,41.75 38.26,41.75 36.83,43.18 v35.88,43.18 | U4.1 38.32,62.8 38.89,62.23 40.8,62.23 41.27,61.75 41.27,57.63 40.16,56.52 40.16,47.31 v38.89,46.04
  Bottom 0.254: v38.89,46.04 36.04,43.18 v35.88,43.18
HORIZONTAL  (via drill 0.51)
  Top 0.254: U5.P$61 57.58,35.83 v58.42,36.67 | v57.47,39.53 54.77,42.23 54.77,65.41 U3.H2
  Bottom 0.254: v58.42,36.67 58.42,38.58 v57.47,39.53
LED1
  Top 0.254: R26.1 34.45,10.91 34.45,14.92 35.56,16.03 35.56,16.99 39.21,20.64 41.75,20.64 42.86,21.75 45.56,21.75 46.97,23.15 U5.P$39
LED2
  Top 0.254: R29.1 33.4,14.67 34.92,16.19 34.92,17.14 38.89,21.11 41.43,21.11 42.55,22.23 45.24,22.23 46.16,23.15 U5.P$38
LED3  (via drill 0.51)
  Top 0.254: R30.1 34.92,7.54 34.92,14.29 v36.83,16.19 | v36.83,20.64 37.78,21.59 41.12,21.59 42.23,22.7 44.93,22.7 45.37,23.14 U5.P$37
  Bottom 0.254: v36.83,16.19 v36.83,20.64
LED4  (via drill 0.51)
  Top 0.254: U5.P$7 49.37,38.73 48.9,38.26 v42.23,38.26 | R34.2 20.91,49.53 23.81,49.53 29.37,43.97 v31.11,43.97
  Bottom 0.254: v42.23,38.26 39.53,38.26 35.72,34.45 34.45,34.45 31.11,37.78 v31.11,43.97
LED5  (via drill 0.51)
  Top 0.254: U5.P$34 42.97,26.3 45.24,28.57 v45.24,33.97 | R35.2 22.61,52.32 v28.89,46.04
  Bottom 0.254: v45.24,33.97 45.24,35.88 44.13,36.99 43.18,36.99 42.86,36.67 39.69,36.67 36.2,33.18 33.81,33.18 28.89,38.1 v28.89,46.04
LED6  (via drill 0.51)
  Top 0.254: U5.P$35 43.77,26.3 46.67,29.21 v46.67,33.97 | v30.16,46.99 29.69,46.99 22.45,54.23 R32.2
  Bottom 0.254: v46.67,33.97 46.67,35.4 44.45,37.62 42.86,37.62 42.55,37.31 39.37,37.31 35.88,33.81 34.13,33.81 30.16,37.78 v30.16,46.99
LED7
  Top 0.254: U5.P$49 57.28,26.23 58.15,25.35 R33.2
MISO  (via drill 0.51)
  Top 0.254: U5.P$13 44.56,41 42.55,43.02 38.58,43.02 CON1.6 34.45,49.69 34.45,52.23 v35.24,53.02 | v35.24,59.21 33.5,60.96 31.11,60.96 29.43,62.64 U4.8
  Bottom 0.254: v35.24,53.02 v35.24,59.21
MOSI
  Top 0.254: U5.P$12 45.37,40.99 42.7,43.66 38.73,43.66 34.45,47.94 34.45,48.9 35.72,50.16 CON1.2 37.05,52.29 U4.15
N$1
  Top 0.254: 51.44,16.95 50.81,16.95 U2.1 | 53.72,10.16 54.99,9.91 55.75,9.14 53.03,9.14 LED10.2
  Top 2.184: 53.72,10.16 53.72,14.67 51.44,16.95
  pour Top (no thermals): 51.5,18.1 49.97,18.1 49.97,16.32 51.5,16.32
  pour Top (no thermals): 57.09,8.57 57.09,10.22 52.77,10.22 52.77,8.57
N$2
  Top 0.61: CON15.1 R16.1
N$3
  pour Top (isolate 0.305, no thermals): 70.8,52.07 71.69,-1.27 86.36,-1.27 99.06,11.43 99.06,39.37 86.36,52.07
N$5  (via drill 0.51)
  Top 0.61: C6.2 79.96,27.79 C8.2 79.89,30.23 C9.2 C7.2 | CON15.3 76.15,27.67 C6.2 | C6.2 80.08,27.74 C12.2 C2.2 | T2.2 81.6,20.96 v80.64,20
  pour Bottom (isolate 0.305, no thermals): 70.8,52.07 71.44,-1.27 86.36,-1.27 99.06,11.43 99.06,39.37 86.36,52.07
N$6
  Top 0.61: LED7.2 83.63,11.03 R25.2
N$9
  Top 0.254: T1.3 10.73,58.37 B1.2 10.49,57.75 R8.1
N$10
  Top 0.61: R13.1 84.02,44.25 89.65,38.62 R12.1 92.51,33.02 R14.1 92.51,17.46 R10.1 90.6,13.45 89.53,12.38 | 89.53,12.38 84.97,7.82 R25.1 81.39,7.82 77.67,11.54 R11.1 | 89.53,12.38 86.36,15.56 86.36,20.24 T2.3
N$11
  Top 0.61: R16.2 82.5,22.86 T2.1
N$13
  Top 0.61: LED2.2 89.1,19.07 R10.2
N$14
  Top 0.61: LED3.2 75.25,7.78 R11.2
N$15
  Top 0.61: LED4.2 86.12,37.91 R12.2
N$16
  Top 0.61: LED5.2 81.45,42.6 R13.2
N$17
  Top 0.61: LED6.2 91.01,27.73 R14.2
N$20
  Top 0.254: T7.3 58.69,12.42 R24.1 58.68,4.71 T3.4
N$21
  Top 0.254: T7.1 56.34,14.46 53.09,17.72 R31.1
N$22
  Top 0.254: LED10.1 R27.2
N$23
  Top 0.61: 50.48,19.75 50.74,19.49 U2.3
  Top 2.184: U$4.1 48.02,18.87 48.9,19.75 50.48,19.75
  Top 2.54: U$3.1 U$4.1
  pour Top (no thermals): 51.5,20.64 49.97,20.64 49.97,18.86 51.5,18.86
N$24
  Top 0.254: R3.2 CON20.4
N$26
  Top 0.254: T1.1 16.59,61.28 R28.2
N$27
  Top 0.254: R2.2 CON19.4
N$28
  Top 0.254: R4.2 CON21.4
N$29
  Top 0.254: R5.2 CON22.4
N$30
  Top 0.254: R6.2 CON23.4
N$31
  Top 0.254: R9.2 CON24.4
N$32
  Top 0.254: R17.2 CON25.4
N$33
  Top 0.254: R18.2 CON26.4
N$34
  Top 0.254: R19.2 CON27.4
N$35
  Top 0.254: R20.2 CON28.4
N$36
  Top 0.254: T4.1 33.52,8.32 R26.2
N$37
  Top 0.254: LED1.1 22,4.53 22.86,5.4 22.86,6.85 R1.2
N$38
  Top 0.254: LED1.3 21.26,9.46 R21.2
N$39
  Top 0.254: LED1.4 17.06,4.53 16.51,5.08 16.51,6.67 21.84,12 R22.2
N$40
  Top 0.254: T5.1 33.51,12.19 R29.2
N$41
  Top 0.254: T6.1 33.35,4.32 R30.2
N$42
  Top 0.254: R32.1 18.55,54.2 LED8.1
N$43
  Top 0.254: R33.1 56.72,23.37 LED9.1
N$44
  Top 0.254: R34.1 18.49,50.39 LED11.1
N$45
  Top 0.254: R35.1 18.62,52.29 LED12.1
N$46
  Top 0.254: LED13.1 R36.1
N$47
  Top 0.254: XTAL2.2 34.88,33.9 C22.1 38.03,33.43 U5.P$23
N$48
  Top 0.254: XTAL2.1 34.95,29.16 C23.1 38.58,30.21 38.58,32.07 39.13,32.63 U5.P$24
N$49
  Top 0.254: CON3.4 R37.2
N$50
  Top 0.254: CON4.4 R38.2
N$51
  Top 0.254: CON5.4 R39.2
N$52
  Top 0.254: CON6.4 R40.2
N$53
  Top 0.254: CON7.4 R41.2
N$54
  Top 0.254: CON8.4 R42.2
N$55  (via drill 0.51)
  Top 0.254: CON13.2 38.26,9.18 v38.26,13.34 | U5.P$25 41.52,31.83 43.81,29.53 v43.81,28.73
  Bottom 0.254: v38.26,13.34 38.42,13.49 38.42,23.34 v43.81,28.73
N$56  (via drill 0.51)
  Top 0.254: CON13.3 37.31,10.76 v37.31,14.61 | U5.P$26 41.36,31.03 42.07,30.32 v42.07,28.73
  Bottom 0.254: v37.31,14.61 37.78,15.08 37.78,23.65 42.07,27.94 v42.07,28.73
N$57
  Top 0.254: R43.1 23.34,23.35 23.34,30.48 26.13,33.27 U6.P$19
N$60
  Top 0.254: CON17.2 31.11,19.21 38.58,26.67 38.58,29.37 39.43,30.23 U5.P$27
N$61
  Top 0.254: CON17.3 33.66,20.8 39.21,26.35 39.21,29.21 39.43,29.43 U5.P$28
RED
  Top 0.254: R1.1 24.44,6.92 CON16.3
  Top 0.406: CON16.3 28.27,6.92 T6.3
RESET  (via drill 0.51)
  Top 0.254: R7.2 31,52.86 v32.23,52.86 | v32.07,59.05 29.11,62.01 S1.3 | U5.P$20 35.19,35.83 v34.92,35.56 | C14.1 23.48,64.9 25.89,62.49 S1.3 | S1.3 S1.4
  Bottom 0.254: v32.07,59.05 32.23,58.9 v32.23,52.86 33.81,52.86 34.45,52.23 34.45,50.32 35.08,49.69 36.99,49.69 CON1.4 36.99,47.15 34.61,47.15 33.18,45.72 33.18,36.67 34.29,35.56 v34.92,35.56
SCK
  Top 0.254: U5.P$11 46.16,40.99 42.86,44.29 38.89,44.29 35.72,47.47 CON1.5 36.99,49.69 36.99,51.44 38.32,52.77 U4.16
TRANSMITLEDS  (via drill 0.51)
  Top 0.254: U5.P$10 46.97,40.98 42.7,45.24 v41.91,45.24 | v36.67,41.75 30.8,41.75 23.65,48.9 CON14.1
  Bottom 0.254: v41.91,45.24 38.42,41.75 v36.67,41.75
VERTICAL  (via drill 0.51)
  Top 0.254: U5.P$60 57.52,35.03 v58.42,34.13 | v61.44,37.15 64.77,37.15 67.94,40.32 67.94,52.23 U3.V2
  Bottom 0.254: v58.42,34.13 v61.44,37.15
WP
  Top 0.254: U5.P$14 43.77,41.01 42.39,42.39 38.42,42.39 33.66,47.15 32.7,47.15 29.43,50.42 U4.9

### Text on the board
tPlace: IRTX | 1 | KEY | - | - | + | 3/19/14 | + | Jeffrey D'Amelio | s | Cal Poly Robotics Club | RXI | TXO | UART | 16 | LEDs | I2C